# Altium schematic sheet Camera_Interface.SCHDOC: Ixora
size A3; Organization: Toradex AG; Address1: Altsagenstrasse 5; Address2: Horw; Address3: 6048; Address4: Switzerland; DocumentNumber: 11; Revision: V1.1; SheetNumber: 11; SheetTotal: 19; PageSetup: Record=PageOptions|CenterHorizontal=True|CenterVertical=True|PrintScale=0.73|XCorrection=1.00|YCorrection=1.00|PrintKind=0|BorderSize=5000000|LeftOffset=0|BottomOffset=0|Orientation=2|PaperLength=1000|PaperWidth=1000|Scale=100|PaperSource=7|PrintQuality=-4|MediaType=1|DitherType=10|PaperKind=A4|PrintScaleMode=1
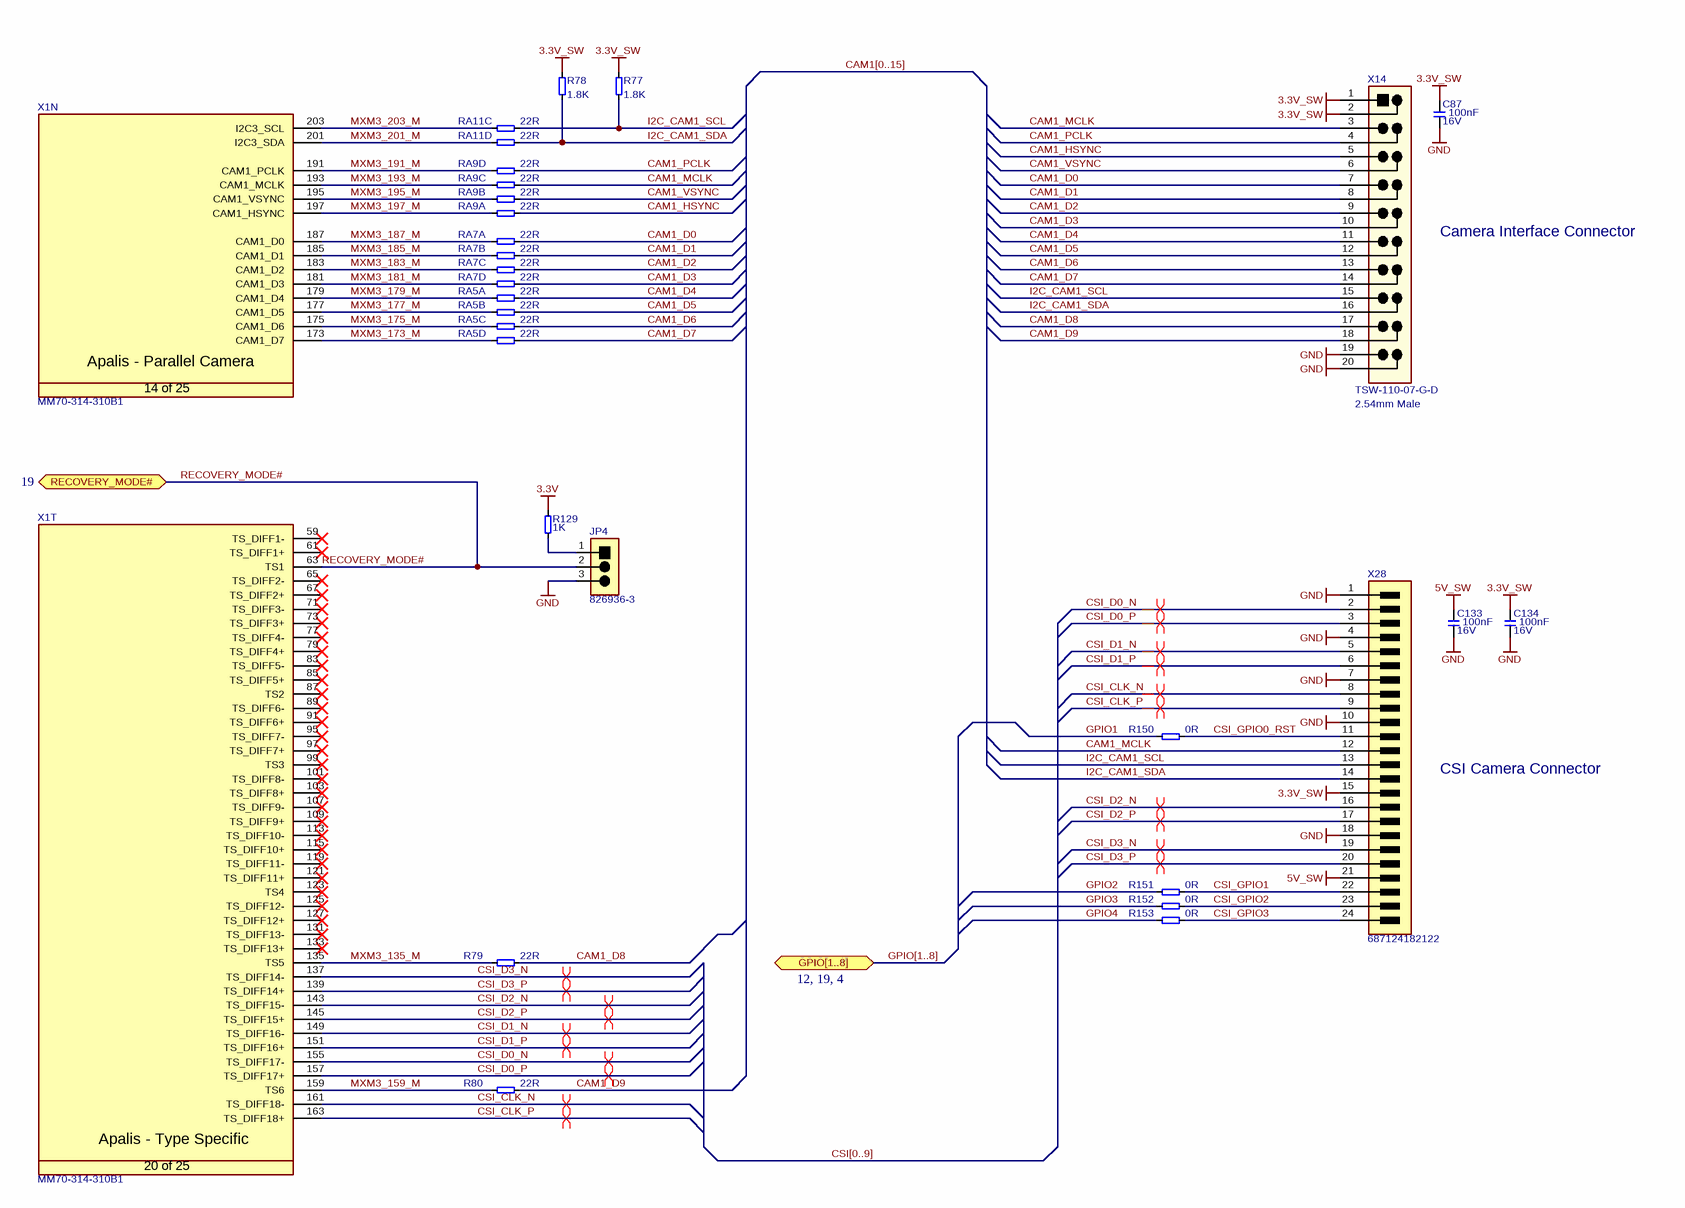
[diagram p0: Camera_Interface.SCHDOC]

## Parts
C87  Rating: 16V  [CAPC1005X60N]  (hidden comment: 100nF)
C133  Rating: 16V  [CAPC1005X60N]  (hidden comment: 100nF)
C134  Rating: 16V  [CAPC1005X60N]  (hidden comment: 100nF)
JP4  826936-3  [T_TYCO_826936-3]
R77  1.8K  [RESC1005X40N]
R78  1.8K  [RESC1005X40N]
R79  22R  [RESC1005X40N]
R80  22R  [RESC1005X40N]
R129  1K  [RESC1005X40N]
R150  0R  [RESC1005X40N]
R151  0R  [RESC1005X40N]
R152  0R  [RESC1005X40N]
R153  0R  [RESC1005X40N]
RA5  22R  [T_Resistor_Array_X4]  (parts A,B,C,D of 4)
RA7  22R  [T_Resistor_Array_X4]  (parts A,B,C,D of 4)
RA9  22R  [T_Resistor_Array_X4]  (parts A,B,C,D of 4)
RA11  22R  [T_Resistor_Array_X4]  (parts C,D of 4)
X1  Manufacturer Part No.: MM70-314-310B1  [T_JAE_MM70-314-310B1]  (hidden comment: CON-JAE-MM70-314-310B1-314-0.5mm)  (parts N,T of 25)
X14  TSW-110-07-G-D  [T_Samtec_TSW-110-07-G-D-Header]
X28  687124182122  [T_Wurth_687124182122 (Mirrored)]

## Ports
GPIO[1..8] (bidir, see 12, 19, 4), RECOVERY_MODE# (bidir, see 19)

## Nets
3.3V: R129.1
3.3V_SW: C87.2 C134.2 R77.1 R78.1 X14.1 X14.2 X28.15
5V_SW: C133.2 X28.21
GND: C87.1 C133.1 C134.1 JP4.3 X14.19 X14.20 X28.1 X28.4 X28.7 X28.10 X28.18
CAM1_D0: RA7.5 X14.7
CAM1_D1: RA7.6 X14.8
CAM1_D2: RA7.7 X14.9
CAM1_D3: RA7.8 X14.10
CAM1_D4: RA5.5 X14.11
CAM1_D5: RA5.6 X14.12
CAM1_D6: RA5.7 X14.13
CAM1_D7: RA5.8 X14.14
CAM1_D8: R79.2 X14.17
CAM1_D9: R80.2 X14.18
CAM1_HSYNC: RA9.5 X14.5
CAM1_MCLK: RA9.7 X14.3 X28.12
CAM1_PCLK: RA9.8 X14.4
CAM1_VSYNC: RA9.6 X14.6
CSI_CLK_N: X1.161(TS_DIFF18-) X28.8
CSI_CLK_P: X1.163(TS_DIFF18+) X28.9
CSI_D0_N: X1.155(TS_DIFF17-) X28.2
CSI_D0_P: X1.157(TS_DIFF17+) X28.3
CSI_D1_N: X1.149(TS_DIFF16-) X28.5
CSI_D1_P: X1.151(TS_DIFF16+) X28.6
CSI_D2_N: X1.143(TS_DIFF15-) X28.16
CSI_D2_P: X1.145(TS_DIFF15+) X28.17
CSI_D3_N: X1.137(TS_DIFF14-) X28.19
CSI_D3_P: X1.139(TS_DIFF14+) X28.20
CSI_GPIO0_RST: R150.1 X28.11
CSI_GPIO1: R151.1 X28.22
CSI_GPIO2: R152.1 X28.23
CSI_GPIO3: R153.1 X28.24
GPIO1: R150.2
GPIO2: R151.2
GPIO3: R152.2
GPIO4: R153.2
I2C_CAM1_SCL: R77.2 RA11.7 X14.15 X28.13
I2C_CAM1_SDA: R78.2 RA11.8 X14.16 X28.14
MXM3_135_M: R79.1 X1.135(TS5)
MXM3_159_M: R80.1 X1.159(TS6)
MXM3_173_M: RA5.4 X1.173(CAM1_D7)
MXM3_175_M: RA5.3 X1.175(CAM1_D6)
MXM3_177_M: RA5.2 X1.177(CAM1_D5)
MXM3_179_M: RA5.1 X1.179(CAM1_D4)
MXM3_181_M: RA7.4 X1.181(CAM1_D3)
MXM3_183_M: RA7.3 X1.183(CAM1_D2)
MXM3_185_M: RA7.2 X1.185(CAM1_D1)
MXM3_187_M: RA7.1 X1.187(CAM1_D0)
MXM3_191_M: RA9.4 X1.191(CAM1_PCLK)
MXM3_193_M: RA9.3 X1.193(CAM1_MCLK)
MXM3_195_M: RA9.2 X1.195(CAM1_VSYNC)
MXM3_197_M: RA9.1 X1.197(CAM1_HSYNC)
MXM3_201_M: RA11.4 X1.201(I2C3_SDA)
MXM3_203_M: RA11.3 X1.203(I2C3_SCL)
RECOVERY_MODE#: JP4.2 X1.63(TS1) ; port RECOVERY_MODE#
NetJP4_1: JP4.1 R129.2

Not connected (* = marked no-connect by the designer): X1 59(TS_DIFF1-)* 61(TS_DIFF1+)* 65(TS_DIFF2-)* 67(TS_DIFF2+)* 71(TS_DIFF3-)* 73(TS_DIFF3+)* 77(TS_DIFF4-)* 79(TS_DIFF4+)* 83(TS_DIFF5-)* 85(TS_DIFF5+)* 87(TS2)* 89(TS_DIFF6-)* 91(TS_DIFF6+)* 95(TS_DIFF7-)* 97(TS_DIFF7+)* 99(TS3)* 101(TS_DIFF8-)* 103(TS_DIFF8+)* 107(TS_DIFF9-)* 109(TS_DIFF9+)* 113(TS_DIFF10-)* 115(TS_DIFF10+)* 119(TS_DIFF11-)* 121(TS_DIFF11+)* 123(TS4)* 125(TS_DIFF12-)* 127(TS_DIFF12+)* 131(TS_DIFF13-)* 133(TS_DIFF13+)*

## Buses and harness runs
bus CAM1[0..15]
bus CSI[0..9]
bus GPIO[1..8] = port GPIO[1..8]

## Layout directives
differential pair: CSI_CLK_N, CSI_CLK_P, CSI_D0_N, CSI_D0_P, CSI_D1_N, CSI_D1_P, CSI_D2_N, CSI_D2_P, CSI_D3_N, CSI_D3_P

## Notes on the sheet
- Camera Interface Connector
- (near X14) 2.54mm Male
- CSI Camera Connector
- Title
- Size:
- Date:
- A3
- Number:
- Time:
- Revision:
- Sheet
- of
- File:
- (in symbol CON-JAE-MM70-314-310B1-314-0.5mm, part N) Apalis - Parallel Camera; 14 of 25
- (in symbol CON-JAE-MM70-314-310B1-314-0.5mm, part T) Apalis - Type Specific; 20 of 25

## Library data of the parts
C87 C133 C134 = C-X7R-100nF-16V-10%-0402: Capacitor Ceramic X7R 100nF 16V 10% 0402; Tolerance: 10%; Type: X7R; Value: 100nF
JP4 = CON-Tyco-826936-3-1X3-2.54mm-JP: Jumper, 3-Pin; Manufacturer Name: Tyco; No. of ways: 1X3; Pitch: 2.54mm; Manufacturer Part No.: 826936-3
R77 R78 = R-1.8KR-63mW-5%-0402: Resistor 1.8 Kohm 63mW 5% 0402; Value: 1.8KR; Rating: 63mW; Tolerance: 5%
R79 R80 = R-22R-63mW-5%-0402: Resistor 22 ohm 63mW 5% 0402; Rating: 63mW; Tolerance: 5%; Value: 22R
R129 = R-1KR-63mW-5%-0402: Resistor 1 Kohm 63mW 5% 0402; Rating: 63mW; Tolerance: 5%; Value: 1K
R150-R153 = R-0R-63mW-1%-0402: Resistor 0 ohm 63mW 1% 0402; Rating: 63mW; Tolerance: 1%; Value: 0R
RA5 RA7 RA9 RA11 = RA-22R-63mW-5%-1206-div: Resistor Array 22 R 63mW 5% 1206; Tolerance: 5%; Power Dissipation: 63mW
  RA5 RA7 RA11: Value: 22R
X1 = CON-JAE-MM70-314-310B1-314-0.5mm: MXM3 Connector; Manufacturer Name: JAE; No. of ways: 314
X14 = CON-Samtec-TSW-110-07-G-D-Header: Header male, 2x10 pin 2.54mm pitch; Manufacturer Name: Samtec; No. of ways: 2x10; Pitch: 2.54mm; Manufacturer Part No.: TSW-110-07-G-D
X28 = CON-Wurth-687124182122 (Mirrored): FFC/FPC Connector, 24 Position, Top and Bottom 0.020" (0.50mm) Surface Mount, Right Angle; Manufacturer Name: Wurth; No. of ways: 24; Pitch: 0.5mm; Manufacturer Part No.: 687124182122